# EAGLE design SD_A2 (EAGLE 7.2.0)
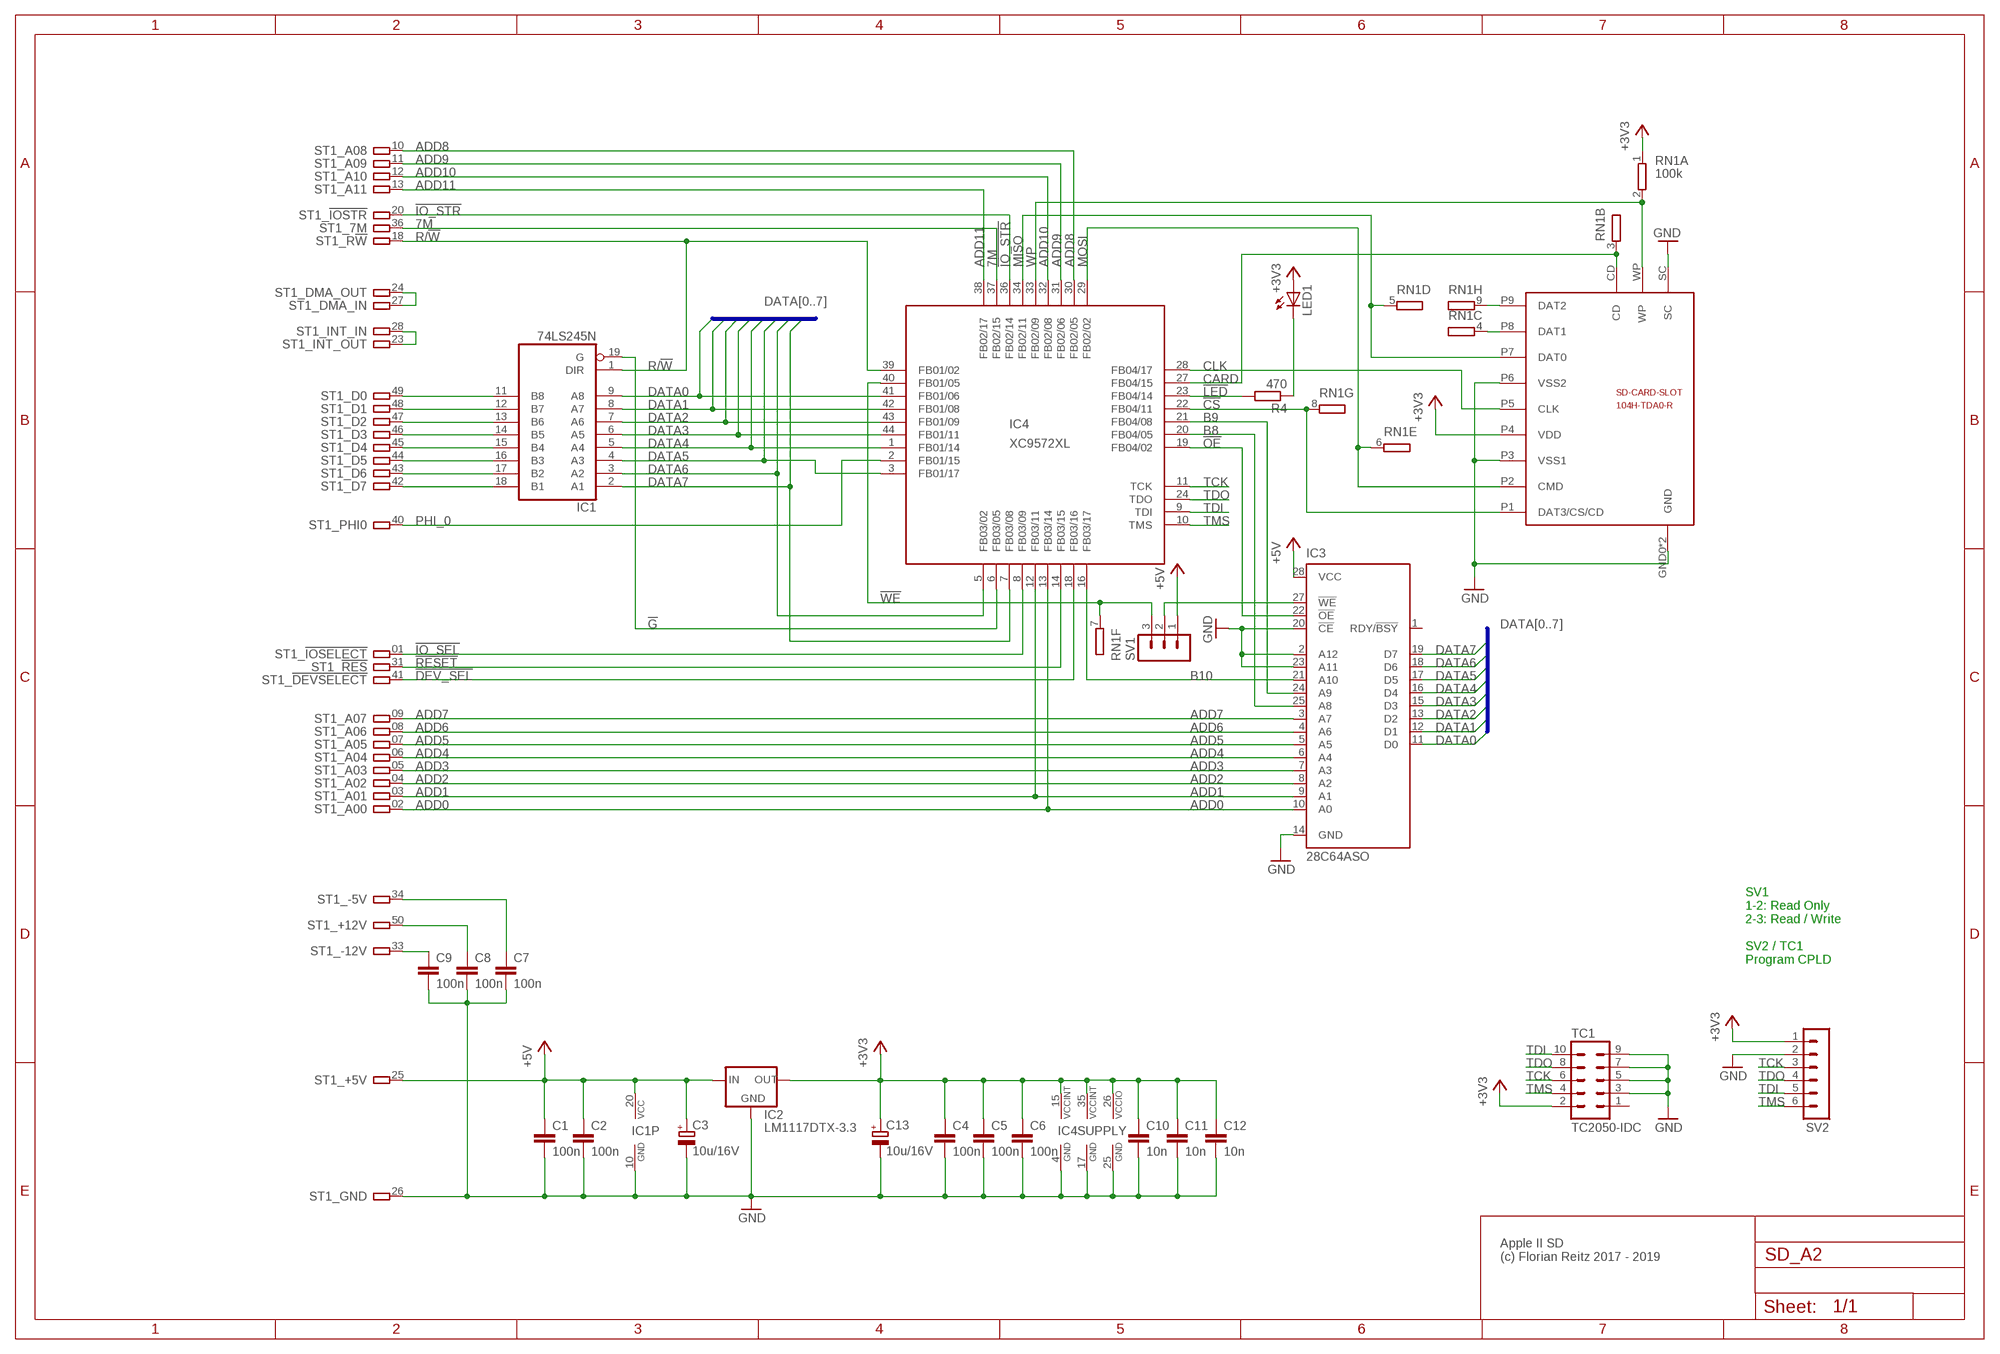
[diagram p0: schematic, sheet 1]

## Parts
C1  100n  C-EUC0603K  [C0603K]
C2  100n  C-EUC0603K  [C0603K]
C3  10u/16V  CPOL-EUA/3216-18R  [A/3216-18R]
C4  100n  C-EUC0603K  [C0603K]
C5  100n  C-EUC0603K  [C0603K]
C6  100n  C-EUC0603K  [C0603K]
C7  100n  C-EUC0603K  [C0603K]
C8  100n  C-EUC0603K  [C0603K]
C9  100n  C-EUC0603K  [C0603K]
C10  10n  C-EUC0603K  [C0603K]
C11  10n  C-EUC0603K  [C0603K]
C12  10n  C-EUC0603K  [C0603K]
C13  10u/16V  CPOL-EUA/3216-18R  [A/3216-18R]
IC1  74LS245N  [DIL20]
IC2  LM1117DTX-3.3  [TO252]
IC3  28C64ASO  [SO28W]
IC4  XC9572XL  XC9572_S44VQFP  [SQFP-S-10X10-44]
LED1  LEDSQR2X5  [LED2X5]
R4  470  R-EU_R0603  [R0603]
RN1  100k  GE08R  [SIL9]
ST1  A2-50PINSLOT1-3  [A2-50PIN-SL1-3]
SV1  MA03-1  [MA03-1]
SV2  MA06-1  [MA06-1]
TC1  TC2050-IDC  [TC2050-IDC]
U$2  104H-TDA0-R  [104H-TDA0-R]

## Nets
7M: IC4.37(FB02/15) ST1.36
!CS: IC4.22(FB04/11) RN1.8 U$2.P1(DAT3/CS/CD)
!DEV_SEL: IC4.18(FB03/16) ST1.41
!G: IC1.19(G) IC4.6(FB03/05)
!IO_SEL: IC4.8(FB03/09) ST1.01
!IO_STR: IC4.36(FB02/14) ST1.20
!LED: IC4.23(FB04/14) R4.2
!OE: IC3.22(!OE) IC4.19(FB04/02)
!RESET: IC4.14(FB03/15) ST1.31
!WE: IC4.40(FB01/05) RN1.7 SV1.3
+3V3: C4.1 C5.1 C6.1 C10.1 C11.1 C12.1 C13.+ IC2.TAB(OUT) IC4.15(VCCINT) IC4.26(VCCIO) IC4.35(VCCINT) LED1.A RN1.1 SV2.1 TC1.2 U$2.P4(VDD)
+5V: C1.1 C2.1 C3.+ IC1.20(VCC) IC2.2(IN) IC3.28(VCC) ST1.25 SV1.1
+12V: C8.1 ST1.50
-5V: C7.1 ST1.34
-12V: C9.1 ST1.33
ADD0: IC3.10(A0) IC4.13(FB03/14) ST1.02
ADD1: IC3.9(A1) IC4.12(FB03/11) ST1.03
ADD2: IC3.8(A2) ST1.04
ADD3: IC3.7(A3) ST1.05
ADD4: IC3.6(A4) ST1.06
ADD5: IC3.5(A5) ST1.07
ADD6: IC3.4(A6) ST1.08
ADD7: IC3.3(A7) ST1.09
ADD8: IC4.30(FB02/05) ST1.10
ADD9: IC4.31(FB02/06) ST1.11
ADD10: IC4.32(FB02/08) ST1.12
ADD11: IC4.38(FB02/17) ST1.13
B8: IC3.25(A8) IC4.20(FB04/05)
B9: IC3.24(A9) IC4.21(FB04/08)
B10: IC3.21(A10) IC4.16(FB03/17)
CARD: IC4.27(FB04/15) RN1.3 U$2.CD
CLK: IC4.28(FB04/17) U$2.P5(CLK)
D0: IC1.11(B8) ST1.49
D1: IC1.12(B7) ST1.48
D2: IC1.13(B6) ST1.47
D3: IC1.14(B5) ST1.46
D4: IC1.15(B4) ST1.45
D5: IC1.16(B3) ST1.44
D6: IC1.17(B2) ST1.43
D7: IC1.18(B1) ST1.42
DAT2: RN1.9 U$2.P9(DAT2)
DATA0: IC1.9(A8) IC3.11(D0) IC4.41(FB01/06)
DATA1: IC1.8(A7) IC3.12(D1) IC4.42(FB01/08)
DATA2: IC1.7(A6) IC3.13(D2) IC4.43(FB01/09)
DATA3: IC1.6(A5) IC3.15(D3) IC4.44(FB01/11)
DATA4: IC1.5(A4) IC3.16(D4) IC4.1(FB01/14)
DATA5: IC1.4(A3) IC3.17(D5) IC4.3(FB01/17)
DATA6: IC1.3(A2) IC3.18(D6) IC4.5(FB03/02)
DATA7: IC1.2(A1) IC3.19(D7) IC4.7(FB03/08)
DMA: ST1.24 ST1.27
GND: C1.2 C2.2 C3.- C4.2 C5.2 C6.2 C7.2 C8.2 C9.2 C10.2 C11.2 C12.2 C13.- IC1.10(GND) IC2.1(GND) IC3.2(A12) IC3.14(GND) IC3.20(!CE) IC3.23(A11) IC4.4(GND) IC4.17(GND) IC4.25(GND) ST1.26 SV2.2 TC1.3 TC1.5 TC1.7 TC1.9 U$2.GND0(GND) U$2.GND1(GND) U$2.P3(VSS1) U$2.P6(VSS2) U$2.SC
INT: ST1.23 ST1.28
MISO: IC4.34(FB02/11) RN1.5 U$2.P7(DAT0)
MOSI: IC4.29(FB02/02) RN1.6 U$2.P2(CMD)
N$1: IC3.27(!WE) SV1.2
N$2: RN1.4 U$2.P8(DAT1)
N$29: LED1.K(C) R4.1
PHI_0: IC4.2(FB01/15) ST1.40
R/!W: IC1.1(DIR) IC4.39(FB01/02) ST1.18
TCK: IC4.11(TCK) SV2.3 TC1.6
TDI: IC4.9(TDI) SV2.5 TC1.10
TDO: IC4.24(TDO) SV2.4 TC1.8
TMS: IC4.10(TMS) SV2.6 TC1.4
WP: IC4.33(FB02/09) RN1.2 U$2.WP
Unconnected: IC3.1(RDY/!BSY) ST1.14 ST1.15 ST1.16 ST1.17 ST1.19 ST1.21 ST1.22 ST1.29 ST1.30 ST1.32 ST1.35 ST1.37 ST1.38 ST1.39 TC1.1

## Buses
DATA[0..7]

## Notes on the sheet
- SV1
  1-2: Read Only
  2-3: Read / Write
  
  SV2 / TC1
  Program CPLD
- Apple II SD
  (c) Florian Reitz 2017 - 2019

## Library data of the parts
C1 C2 C4-C12 = rcl:C-EU: CAPACITOR, European symbol; SPICEPREFIX: C
C3 C13 = rcl@1:CPOL-EU: POLARIZED CAPACITOR, European symbol; SPICEPREFIX: C
IC1 = 74xx-eu:74*245: Octal BUS TRANSCEIVER, 3-state
IC2 = lm1117:LM1117DTX-*
IC3 = microchip:28*64A: CMOS EEPROM 64 K (8 K x 8), low voltage; MPN: CAT28C64BWI-12; OC_FARNELL: 1718312; OC_NEWARK: 06R0739
IC4 = xilinx-xc9:XC9572_S44
LED1 = led:LED: LED OSRAM: - CHIPLED LG R971, LG N971, LY N971, LG Q971, LY Q971, LO R971, LY R971 LH N974, LH R974 LS Q976, LO Q976, LY Q976 LO Q996 - Hyper CHIPLED LW Q18S LB Q993, LB Q99A, LB R99A - SideLED LS A670, LO A670, LY A670, LG A670, LP A670 LB A673, LV A673, LT A673, LW A673 LH A674 LY A675 LS A676, LA A676, LO A676, LY A676, LW A676 LS A679, LY A679, LG A679 - Hyper Micro SIDELED® LS Y876, LA Y876, LO Y876, LY Y876 LT Y87S - SmartLED LW L88C, LW L88S LB L89C, LB L89S, LG L890 LS L89K, LO L89K, LY L89K LS L896, LA L896, LO L896, LY L896 - TOPLED LS T670, LO T670, LY T670, LG T670, LP T670 LSG T670, LSP T670, LSY T670, LOP T670, LYG T670 LG T671, LOG T671, LSG T671 LB T673, LV T673, LT T673, LW T673 LH T674 LS T676, LA T676, LO T676, LY T676, LB T676, LH T676, LSB T676, LW T676 LB T67C, LV T67C, LT T67C, LS T67K, LO T67K, LY T67K, LW E67C LS E67B, LA E67B, LO E67B, LY E67B, LB E67C, LV E67C, LT E67C LW T67C LS T679, LY T679, LG T679 LS T770, LO T770, LY T770, LG T770, LP T770 LB T773, LV T773, LT T773, LW T773 LH T774 LS E675, LA E675, LY E675, LS T675 LS T776, LA T776, LO T776, LY T776, LB T776 LHGB T686 LT T68C, LB T68C - Hyper Mini TOPLED® LB M676 - Mini TOPLED Santana® LG M470 LS M47K, LO M47K, LY M47K Source: http://www.osram.convergy.de LUXEON: - LUMILED® LXK2-PW12-R00, LXK2-PW12-S00, LXK2-PW14-U00, LXK2-PW14-V00 LXK2-PM12-R00, LXK2-PM12-S00, LXK2-PM14-U00 LXK2-PE12-Q00, LXK2-PE12-R00, LXK2-PE12-S00, LXK2-PE14-T00, LXK2-PE14-U00 LXK2-PB12-K00, LXK2-PB12-L00, LXK2-PB12-M00, LXK2-PB14-N00, LXK2-PB14-P00, LXK2-PB14-Q00 LXK2-PR12-L00, LXK2-PR12-M00, LXK2-PR14-Q00, LXK2-PR14-R00 LXK2-PD12-Q00, LXK2-PD12-R00, LXK2-PD12-S00 LXK2-PH12-R00, LXK2-PH12-S00 LXK2-PL12-P00, LXK2-PL12-Q00, LXK2-PL12-R00 Source: www.luxeon.com KINGBRIGHT: KA-3528ASYC Source: www.kingbright.com
R4 = rcl:R-EU_: RESISTOR, European symbol; SPICEPREFIX: R
RN1 = resistor-sil:GE08R: SIL RESISTOR; OC_FARNELL: unknown; OC_NEWARK: unknown
ST1 = con-apple2:A2-50PIN: Apple ][ Peripheral Card Connector This is the, default, 50-pin connector for slot #1 to #7 Pins are laid out as seen from the top of the slot
SV1 = con-lstb:MA03-1: PIN HEADER; OC_FARNELL: unknown; OC_NEWARK: unknown
SV2 = con-lstb:MA06-1: PIN HEADER; OC_FARNELL: unknown; OC_NEWARK: unknown
TC1 = TagConnect:TC2050-IDC: Tag-Connect In Circuit Programming & Debug Cable 10 Pin http://www.tag-connect.com
U$2 = con-sd-attend2:104H-TDA0-R

## Board
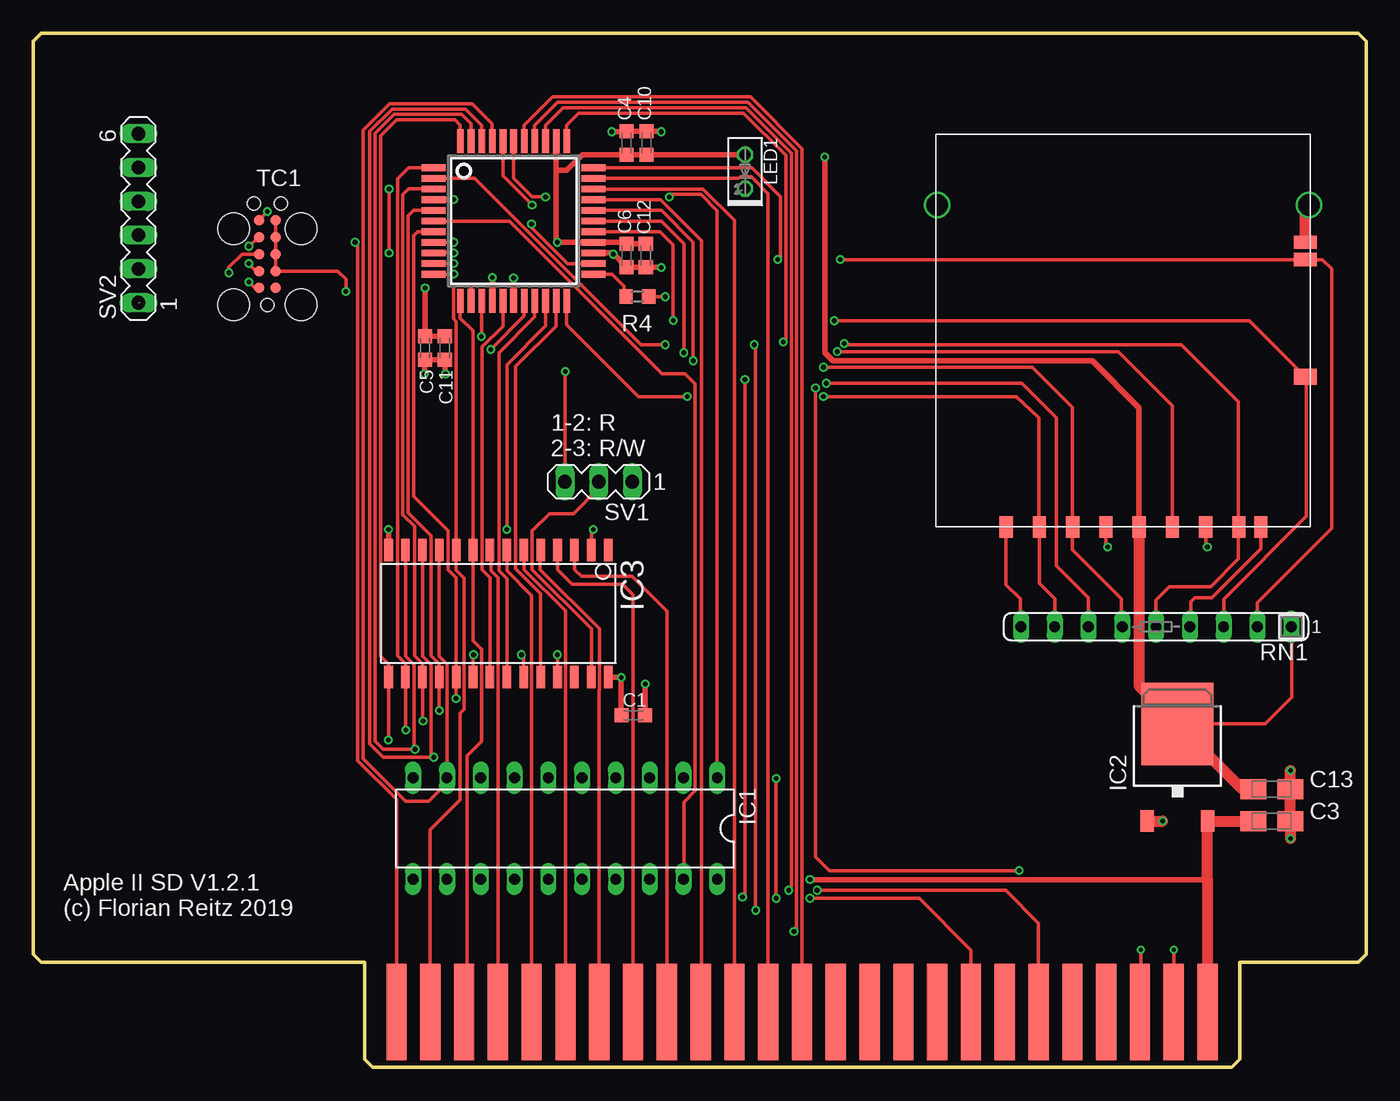
[diagram p1: board, top side]
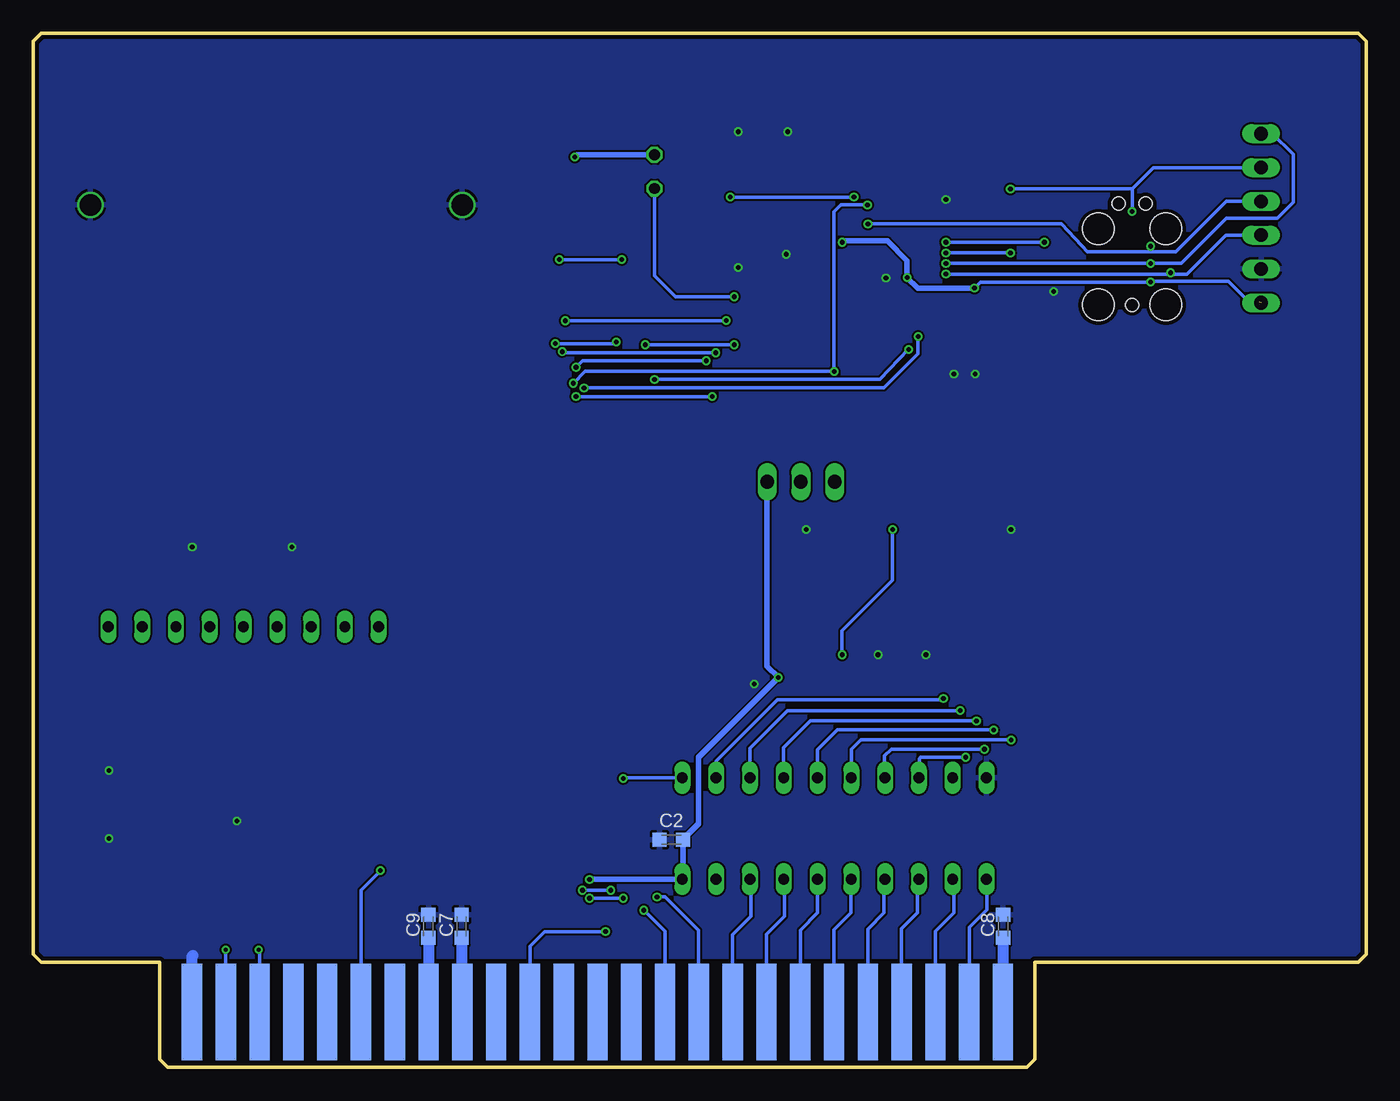
[diagram p2: board, bottom side, seen from below]

Size 100.2 x 77.7 mm. Coordinates in mm from the lower left corner, seen from the top.
Outline: 0.6,7.9 24.9,7.9 24.9,0.6 25.5,0 90.1,0 90.7,0.6 90.7,7.9 99.6,7.9 100.2,8.5 100.2,77.1 99.6,77.7 0.6,77.7 0,77.1 0,8.5 0.6,7.9
Copper layers (1*16): Top 0.035mm / dielectric 1.5mm / Bottom 0.035mm
Design rules "PCB-POOL Standard": minimum track width 0.15mm, minimum drill 0.3mm, track to track 0.15mm, track to pad 0.15mm, pad to pad 0.15mm, via to via 0.15mm, smd to smd 0.15mm, copper to edge 0.3mm, drill to drill 0.2mm, minimum pad ring 0.2mm, minimum via ring 0.15mm, stop-mask expansion 0.075mm, vias tented up to drill 0mil, thermal gap 0.2mm

### Footprints (pad centres in the part's own frame; a part is rotated, then mirrored left to right if it is on the bottom)
C0603K = smd 1.05 x 1.08: 1 -0.875,0; 2 0.875,0
A/3216-18R = smd 1.95 x 1.5: + 1.375,0; - -1.375,0
DIL20 = drill 0.813 long: 1 -11.43,-3.81; 2 -8.89,-3.81; 3 -6.35,-3.81; 4 -3.81,-3.81; 5 -1.27,-3.81; 6 1.27,-3.81; 7 3.81,-3.81; 8 6.35,-3.81; 9 8.89,-3.81; 10 11.43,-3.81; 11 11.43,3.81; 12 8.89,3.81; 13 6.35,3.81; 14 3.81,3.81; 15 1.27,3.81; 16 -1.27,3.81; 17 -3.81,3.81; 18 -6.35,3.81; 19 -8.89,3.81; 20 -11.43,3.81
TO252 = smd 1 x 1.6: 1 -2.28,-4.8; 2 2.28,-4.8 | smd 5.4 x 6.2: TAB 0,2.5
SO28W = smd 0.65 x 1.7: 1 -7.62,-4.78; 2 -6.35,-4.78; 3 -5.08,-4.78; 4 -3.81,-4.78; 5 -2.54,-4.78; 6 -1.27,-4.78; 7 0,-4.78; 8 1.27,-4.78; 9 2.54,-4.78; 10 3.81,-4.78; 11 5.08,-4.78; 12 6.35,-4.78; 13 7.62,-4.78; 14 8.89,-4.78; 15 8.89,4.78; 16 7.62,4.78; 17 6.35,4.78; 18 5.08,4.78; 19 3.81,4.78; 20 2.54,4.78; 21 1.27,4.78; 22 0,4.78; 23 -1.27,4.78; 24 -2.54,4.78; 25 -3.81,4.78; 26 -5.08,4.78; 27 -6.35,4.78; 28 -7.62,4.78
SQFP-S-10X10-44 = smd 0.5 x 1.8: 1 -4,-6; 2 -3.2,-6; 3 -2.4,-6; 4 -1.6,-6; 5 -0.8,-6; 6 0,-6; 7 0.8,-6; 8 1.6,-6; 9 2.4,-6; 10 3.2,-6; 11 4,-6; 23 4,6; 24 3.2,6; 25 2.4,6; 26 1.6,6; 27 0.8,6; 28 0,6; 29 -0.8,6; 30 -1.6,6; 31 -2.4,6; 32 -3.2,6; 33 -4,6 | smd 1.8 x 0.5: 12 6,-4; 13 6,-3.2; 14 6,-2.4; 15 6,-1.6; 16 6,-0.8; 17 6,0; 18 6,0.8; 19 6,1.6; 20 6,2.4; 21 6,3.2; 22 6,4; 34 -6,4; 35 -6,3.2; 36 -6,2.4; 37 -6,1.6; 38 -6,0.8; 39 -6,0; 40 -6,-0.8; 41 -6,-1.6; 42 -6,-2.4; 43 -6,-3.2; 44 -6,-4
LED2X5 = drill 0.813 octagon: A -1.27,0; K 1.27,0
R0603 = smd 1 x 1.1: 1 -0.85,0; 2 0.85,0
SIL9 = drill 0.813 long: 1 -10.16,0; 2 -7.62,0; 3 -5.08,0; 4 -2.54,0; 5 0,0; 6 2.54,0; 7 5.08,0; 8 7.62,0; 9 10.16,0
A2-50PIN-SL1-3 = smd 1.524 x 7.239: 01 -73.025,4.064; 02 -70.485,4.064; 03 -67.945,4.064; 04 -65.405,4.064; 05 -62.865,4.064; 06 -60.325,4.064; 07 -57.785,4.064; 08 -55.245,4.064; 09 -52.705,4.064; 10 -50.165,4.064; 11 -47.625,4.064; 12 -45.085,4.064; 13 -42.545,4.064; 14 -40.005,4.064; 15 -37.465,4.064; 16 -34.925,4.064; 17 -32.385,4.064; 18 -29.845,4.064; 19 -27.305,4.064; 20 -24.765,4.064; 21 -22.225,4.064; 22 -19.685,4.064; 23 -17.145,4.064; 24 -14.605,4.064; 25 -12.065,4.064 | smd 1.524 x 7.239 bottom: 26 -12.065,4.064; 27 -14.605,4.064; 28 -17.145,4.064; 29 -19.685,4.064; 30 -22.225,4.064; 31 -24.765,4.064; 32 -27.305,4.064; 33 -29.845,4.064; 34 -32.385,4.064; 35 -34.925,4.064; 36 -37.465,4.064; 37 -40.005,4.064; 38 -42.545,4.064; 39 -45.085,4.064; 40 -47.625,4.064; 41 -50.165,4.064; 42 -52.705,4.064; 43 -55.245,4.064; 44 -57.785,4.064; 45 -60.325,4.064; 46 -62.865,4.064; 47 -65.405,4.064; 48 -67.945,4.064; 49 -70.485,4.064; 50 -73.025,4.064
MA03-1 = drill 1.016 long: 1 -2.54,0; 2 0,0; 3 2.54,0
MA06-1 = drill 1.016 long: 1 -6.35,0; 2 -3.81,0; 3 -1.27,0; 4 1.27,0; 5 3.81,0; 6 6.35,0
TC2050-IDC = smd 0.787 x 0.787: 1 -2.54,-0.635; 2 -2.54,0.635; 3 -1.27,-0.635; 4 -1.27,0.635; 5 0,-0.635; 6 0,0.635; 7 1.27,-0.635; 8 1.27,0.635; 9 2.54,-0.635; 10 2.54,0.635 | hole 0.991: -3.81,0; 3.81,1.016; 3.81,-1.016 | hole 2.375: -3.81,2.54; -3.81,-2.54; 1.905,2.54; 1.905,-2.54
104H-TDA0-R = smd 1.2 x 1.75: CD 11.3,-13.125 | drill 1.6: GND0 24.2,-13.4; GND1 24.2,14.55 | smd 1.6 x 1: P1 0,6.875; P2 0,4.375; P3 0,1.875; P4 0,-0.625; P5 0,-3.125; P6 0,-5.625; P7 0,-8.125; P8 0,-9.775; P9 0,9.375 | smd 1 x 1.75: SC 21.4,-13.125; WP 20.1,-13.125

### Placement (x,y rotation side)
C1  45.1,26.45 0 top
C2  52.25,17.1 180 bottom
C3  93.1,18.5 180 top
C4  44.6,69.45 90 top
C5  29.45,54.05 270 top
C6  44.6,61 270 top
C7  68,10.6 90 bottom
C8  27.3,10.6 90 bottom
C9  70.5,10.6 90 bottom
C10  46.1,69.45 90 top
C11  30.95,54.05 270 top
C12  46.05,61 270 top
C13  93.1,20.9 180 top
IC1  39.98,17.95 180 top
IC2  86,23.3 0 top
IC3  35.6,34.1 180 top
IC4  36.11,63.59 270 top
LED1  53.51,67.3 270 top
R4  45.41,57.92 180 top
RN1  84.4,33.1 180 top
ST1  100.33,0.1 0 top
SV1  42.5,44 180 top
SV2  7.9,63.8 90 top
TC1  17.6,61.1 90 top
U$2  82.5,40.6 90 top

### Tracks (layer width: path | path; a pad name or v marks a point on that pad's centre or on a via)
7M  (via drill 0.35)
  Top 0.254: v57.18,10.2 57.38,10.4 57.38,68.86 53.73,72.51 39.41,72.51 37.7,70.8 IC4.37
  Bottom 0.254: ST1.36 62.87,9.09 61.75,10.2 v57.18,10.2
  Bottom 0.4: 62.97,4.64 ST1.36
!CS  (via drill 0.35)
  Top 0.254: IC4.22 40.1,55.8 45.5,50.4 v49.15,50.4 | RN1.8 76.8,33.12 76.8,35.2 75.62,36.38 U$2.P1 75.6,40.62 75.6,48.8 73.9,50.4 v59.4,50.4
  Bottom 0.254: v59.4,50.4 v49.15,50.4
!DEV_SEL  (via drill 0.35)
  Top 0.254: IC4.18 36.91,56.46 v34.4,53.95 | v53.5,51.69 53.5,12.89 53.41,12.8 v53.31,12.8
  Bottom 0.254: ST1.41 50.2,4.58 50.2,10.3 52.7,12.8 v53.31,12.8 | v53.5,51.69 36.55,51.69 v34.4,53.95
!G
  Top 0.254: IC1.19 48.9,14.17 48.9,19.93 49.75,20.79 49.75,51.35 49,52.1 47.28,52.1 35.81,63.57 35.81,63.59 IC4.6
!IO_SEL  (via drill 0.35)
  Top 0.254: ST1.01 27.3,4.55 27.3,20.13 24.4,23.03 24.4,61.8 v24.2,62 | IC4.8 v31.59,61.99 v31.6,62
  Bottom 0.254: v31.6,62 v24.2,62
!IO_STR  (via drill 0.35)
  Top 0.254: IC4.36 38.5,70.8 39.81,72.11 53.56,72.11 56.98,68.69 56.98,13.6 56.78,13.4 v56.78,13.3 | ST1.20 75.56,10.83 73.1,13.3 v58.92,13.3
  Bottom 0.254: v56.78,13.3 v58.92,13.3
!LED
  Top 0.254: IC4.23 43.51,59.59 44.4,58.7 44.4,58.08 R4.2
!OE
  Top 0.254: IC3.22 35.6,36.73 35,37.33 35,53.7 37.7,56.4 IC4.19
!RESET  (via drill 0.35)
  Top 0.254: IC4.14 33.71,54.96 v33.67,54.93 | v58.8,51.05 58.8,15.81 59.83,14.78 v74.1,14.78
  Bottom 0.254: 75.6,4.58 ST1.31 75.56,13.31 v74.1,14.78 | v33.67,54.93 33.7,54.9 33.7,53.6 36.25,51.05 v58.8,51.05 58.74,51.09
!WE  (via drill 0.35)
  Top 0.254: 35.31,68.85 IC4.40 35.3,67 v37.5,64.8 | v59.6,51.4 74.3,51.4 76.9,48.8 76.9,37.7 79.3,35.3 79.3,33.12 RN1.7 | v39.99,52.29 39.99,44.03 SV1.3
  Bottom 0.254: v39.99,52.29 58.71,52.29 v59.6,51.4 | 40,52.31 v39.99,52.29 | v37.5,64.8 39.5,64.8 40,64.3 40,52.31 v39.99,52.29
+3V3  (via drill 0.35)  (1 unrouted)
  Top 0.254: 83.25,40.73 U$2.P4 | 44.48,61.99 C6.1 | LED1.A | 39.33,67.4 39.31,67.42 | 60.88,53.1 | v39.4,61.99 v39.4,62 39.31,62.08 | IC2.TAB 92.6,25.8 94.6,27.8 94.6,33.06 RN1.1 | 16.74,58.56 TC1.2 16.64,58.56 v16.2,59
  Top 0.406: v59.5,68.4 59.5,53.7 60.11,53.1 60.88,53.1 | 44.48,61.99 IC4.26 v39.4,61.99 | C6.1 C12.1 | LED1.A C10.1 C4.1 41.27,68.57 40.1,67.4 39.33,67.4 | IC4.15 v34.51,59.34 | IC4.35 39.31,67.42 39.31,62.08 | C11.1 C5.1 v29.45,58.55 | U$2.P4 83.12,49.58 79.6,53.1 60.88,53.1
  Top 0.813: U$2.P4 83.12,28.68 IC2.TAB 90.9,20.9 C13.+
  Bottom 0.254: 59.33,68.57 v59.5,68.4 | 39.29,62.1 v39.4,62 | v29.45,58.55 29,59 v16.2,59 16.15,59.05 10.35,59.05 8.8,57.5 8.05,57.5
  Bottom 0.406: LED1.A 59.33,68.57 | 39.29,62.1 36,62.1 34.51,60.61 v34.51,59.34 33.72,58.55 v29.45,58.55
+5V  (via drill 0.35)
  Top 0.254: 44.18,29.32 v44.2,29.3
  Top 0.406: IC3.28 44.18,29.32 | v44.2,29.3 44.2,26.48 C1.1 | 88.27,14.08 88.25,14.1 v58.39,14.1
  Top 0.813: ST1.25 88.27,14.08 88.27,18.49 IC2.2 C3.+
  Bottom 0.254: v44.2,29.3 44.23,29.33 | 51.38,14.17 IC1.20 | C2.1 51.38,17.12
  Bottom 0.406: 51.38,14.17 C2.1 | 51.38,17.12 50.2,18.3 50.2,23.3 v44.2,29.3 45.04,30.14 SV1.1 | IC1.20 58.35,14.14 v58.39,14.1
+12V
  Bottom 0.254: ST1.50 27.3,4.55
  Bottom 0.813: C8.1 27.3,4.55 ST1.50
-5V
  Bottom 0.254: 68,4.6 ST1.34
  Bottom 0.813: C7.1 68,4.6
-12V
  Bottom 0.254: 70.5,4.56 ST1.33
  Bottom 0.813: C9.1 70.5,4.56
ADD0
  Top 0.254: IC3.10 | IC3.10 31.79,37.37 32.4,36.76 32.4,26.9 32.1,26.6 32.1,20.1 29.84,17.85 ST1.02 | IC4.13 32.91,58.59 32.7,58.8 31.78,58.8 31.58,58.61 31.58,56.25 31.79,56.04 IC3.10
ADD1
  Top 0.254: ST1.03 32.6,4.76 32.6,23.4 33.7,24.5 33.7,31.4 33.06,32.04 IC3.9 33.06,55.34 32.1,56.3 IC4.12
ADD2
  Top 0.254: ST1.04 34.92,28.35 34.93,28.36 34.93,36.77 34.4,37.3 34.4,38.81 IC3.8
ADD3
  Top 0.254: ST1.05 37.47,28.35 37.47,28.36 37.47,35.43 35.6,37.3 IC3.7
ADD4
  Top 0.254: ST1.06 40.01,28.35 40.01,28.36 40.01,34.29 36.9,37.4 36.9,38.85 IC3.6
ADD5
  Top 0.254: ST1.07 42.55,28.35 42.55,28.36 42.55,32.95 38.1,37.4 38.1,38.84 IC3.5
ADD6
  Top 0.254: ST1.08 45.1,4.56 45.1,35.5 44.3,36.3 40.5,36.3 39.4,37.4 IC3.4
ADD7
  Top 0.254: ST1.09 47.62,34.27 45,36.9 41.2,36.9 40.7,37.4 40.7,38.86 IC3.3
ADD8
  Top 0.254: ST1.10 50.25,4.63 50.25,62.1 47.16,65.19 IC4.30
ADD9
  Top 0.254: ST1.11 52.7,63.65 50.36,65.99 IC4.31
ADD10
  Top 0.254: ST1.12 55.24,65.66 53.99,66.91 53.88,66.91 | IC4.32 53.02,66.79 53.14,66.91 53.88,66.91 | 53.88,66.91 53.89,66.9
ADD11
  Top 0.254: IC4.38 36.9,70.8 39.02,72.92 53.9,72.92 57.78,69.03 ST1.13
B8  (via drill 0.35)
  Top 0.254: IC4.20 38.51,55.71 35.6,52.8 v35.6,40.4 | IC3.25 v39.41,30.99 v39.4,31
  Bottom 0.254: v39.4,31 39.4,32.8 35.6,36.6 v35.6,40.4
B9
  Top 0.254: IC3.24 38.14,35.59 36.27,37.46 36.27,52.67 39.3,55.7 IC4.21
B10
  Top 0.254: IC3.21 34.33,36.8 33.73,37.4 33.73,54.13 35.3,55.7 IC4.16
CARD  (via drill 0.35)
  Top 0.254: IC4.27 47.11,62.79 48.1,61.8 v48.1,56.1 | v60.2,56.1 91.42,56.1 U$2.CD 95.7,51.83 95.7,41.4 89.48,35.18 RN1.3
  Bottom 0.254: v48.1,56.1 60.1,56.1 v60.2,56.1
CLK  (via drill 0.35)
  Top 0.254: U$2.P5 85.62,49.73 81.58,53.77 v60.43,53.77 | IC4.28 47.21,63.59 48.9,61.9 v48.9,53.7
  Bottom 0.254: v48.9,53.7 60.35,53.7 v60.43,53.77
D0
  Bottom 0.254: ST1.49 29.84,10.5 28.5,11.85 28.5,14.09 IC1.11
D1
  Bottom 0.254: ST1.48 32.38,10.21 31,11.6 31,14.05 IC1.12
D2
  Bottom 0.254: ST1.47 34.92,10.42 33.75,11.6 33.75,14.02 IC1.13
D3
  Bottom 0.254: ST1.46 37.47,10.38 36.25,11.6 36.25,14.06 IC1.14
D4
  Bottom 0.254: ST1.45 40.01,10.34 38.75,11.6 38.75,14.1 IC1.15
D5
  Bottom 0.254: ST1.44 42.55,10.3 41.25,11.6 IC1.16
D6
  Bottom 0.254: ST1.43 45.09,10.01 43.75,11.35 43.75,14.1 IC1.17
D7
  Bottom 0.254: ST1.42 47.62,9.97 46.25,11.35 46.25,14.06 IC1.18
DAT2
  Top 0.254: U$2.P9 73.12,36.27 74.2,35.2 74.2,33.14 RN1.9
DATA0
  Top 0.254: 30.5,38.9 IC3.11 30.52,30.89 31.12,30.29 31.12,21.79 IC1.9 31.09,21.39 29.7,20 28,20 24.8,23.2 24.8,70.41 26.8,72.41 32.99,72.41 34.5,70.9 IC4.41
DATA1  (via drill 0.35)
  Top 0.254: 29.3,38.93 IC3.12 29.25,30.89 29.9,30.24 29.9,23.5 v30.1,23.3 28.45,23.3 26.3,23.3 25.29,24.31 25.29,70.34 26.96,72.01 32.49,72.01 33.7,70.8 IC4.42
  Bottom 0.254: v30.1,23.3 33.5,23.3 33.6,23.2 33.6,21.79 IC1.8
DATA2  (via drill 0.35)
  Top 0.254: IC3.13 27.98,30.89 28.61,30.25 28.61,23.99 v28.7,23.9 26.3,23.9 25.7,24.5 25.7,38.32 25.7,38.33 25.7,70.17 27.13,71.6 32.2,71.6 32.9,70.9 IC4.43
  Bottom 0.254: v28.7,23.9 35.7,23.9 36.2,23.4 36.2,21.79 IC1.7
DATA3  (via drill 0.35)
  Top 0.254: IC3.15 v26.71,24.61 v26.7,24.6 | IC4.44 32.1,70.8 31.7,71.2 27.3,71.2 26.1,70 26.1,30.9 26.71,30.29 IC3.15 | IC3.15
  Bottom 0.254: v26.7,24.6 38,24.6 38.71,23.89 IC1.6
DATA4  (via drill 0.35)
  Top 0.254: v28.01,25.35 27.98,25.38 IC3.16 27.98,30.32 27.38,30.92 27.38,66.78 28.2,67.6 IC4.1
  Bottom 0.254: v28.01,25.35 39.75,25.35 41.25,23.85 IC1.5
DATA5  (via drill 0.35)
  Top 0.254: v29.3,26.03 29.25,26.08 IC3.17 29.25,30.32 28.65,30.92 28.65,40.65 27.78,41.52 27.78,65.58 28.2,66 IC4.3
  Bottom 0.254: IC1.4 43.79,23.21 43.8,23.22 43.8,24 41.77,26.03 v29.3,26.03
DATA6  (via drill 0.35)
  Top 0.254: IC4.5 28.6,64.4 28.19,63.99 28.19,41.69 29.92,39.95 29.92,30.92 30.52,30.32 IC3.18 v30.52,26.8
  Bottom 0.254: IC1.3 46.33,23.97 43.5,26.8 v30.52,26.8
DATA7  (via drill 0.35)
  Top 0.254: v31.78,27.7 IC3.19 31.79,36.8 31.19,37.4 31.19,39.84 31.2,39.86 31.2,40.3 28.59,42.91 28.59,62.49 28.89,62.79 IC4.7
  Bottom 0.254: v31.78,27.7 31.88,27.6 44.25,27.6 48.87,22.98 IC1.2
DMA  (via drill 0.3 pad 0.6)
  Top 0.254: ST1.27 85.72,8.82 v85.75,8.85
  Bottom 0.254: v85.75,8.85 85.75,4.57 ST1.27
GND  (via drill 0.35)
  Top 0.254: U$2.P3 80.62,39.23 v80.75,39.1 | U$2.P6 88.12,39.23 v88.25,39.1 | IC3.2 41.95,40.25 v42.1,40.4 | IC3.23 36.87,30.83 v36.7,31 | IC3.20 33.06,30.96 v33.1,31 | v26.71,40.4 | v31.59,65.19 v31.6,65.2 | v36.11,59.29 v36.1,59.3 | 47.17,60.12 v47.2,60.1 | 47.17,70.32 v47.2,70.3 | 45.98,28.78 v46,28.8 | 30.95,52.15 v31,52.1 | v23.5,58.3 23.5,59.2 22.87,59.83 TC1.3 TC1.5 TC1.7 TC1.9
  Top 0.406: IC3.14 v26.71,40.4 | IC4.4 v31.59,65.19 | IC4.17 v36.11,59.29 | IC4.25 43.53,61.19 C6.2 C12.2 47.17,60.12 | C4.2 C10.2 47.17,70.32 | C1.2 45.98,28.78 | C5.2 C11.2 30.95,52.15 | 44.6,70.3 v43.5,70.3 | 29.5,53.1 29.4,53.1 v29.4,52.1
  Top 0.813: IC2.1 v84.9,18.5 | C3.- C13.- 94.47,22.28 v94.5,22.3 | U$2.SC 95.62,64.52 U$2.GND0 | 94.5,18.5 v94.5,17.2
  Bottom 0.813: ST1.26 88.27,8.33 88.2,8.4
  other vias: 43.6,61.1
  pour Bottom: 0.5,77.35 99.75,77.35 99.75,8.35 0.5,8.35
INT  (via drill 0.3 pad 0.6)
  Top 0.254: v83.25,8.85 83.25,4.61 ST1.23
  Bottom 0.254: ST1.23 83.19,8.79 v83.25,8.85
MISO  (via drill 0.35)
  Top 0.254: 90.6,40.58 90.6,38.2 88.5,36.1 85.4,36.1 84.4,35.1 RN1.5 | 90.6,40.58 U$2.P7 | 90.6,40.58 90.6,50 86.3,54.3 61.03,54.3 v60.96,54.38 | IC4.34 40.1,70.8 41.01,71.7 53.4,71.7 56.57,68.53 56.57,54.69 v56.38,54.5
  Bottom 0.254: v60.96,54.38 56.49,54.38 v56.38,54.5
MOSI  (via drill 0.35)
  Top 0.254: U$2.P2 78.1,40.58 | IC4.29 47.21,64.39 49.6,62 v49.6,53.09 | U$2.P2 78.12,38.88 81.8,35.2 81.8,33.16 RN1.6 | v59.4,52.6 75.1,52.6 78.1,49.6 78.1,40.62 U$2.P2
  Bottom 0.254: v49.6,53.09 58.91,53.09 v59.4,52.6
N$1
  Top 0.254: IC3.27 41.95,32.95 37.5,37.4 37.5,40.3 38.8,41.6 40.6,41.6 42.5,43.5 SV1.2
N$2
  Top 0.254: U$2.P8 92.28,38.98 88.6,35.3 87.3,35.3 87,35 87,33.16 RN1.4
N$29  (via drill 0.35)
  Top 0.254: R4.1 47.48,57.92 v47.5,57.9
  Bottom 0.254: v47.5,57.9 51.93,57.9 53.51,59.48 LED1.K
PHI_0  (via drill 0.35)
  Top 0.254: IC4.2 33.18,66.79 45.67,54.3 v47.5,54.3 | v54.3,11.8 54.3,54.2 v54.2,54.3
  Bottom 0.254: v54.2,54.3 v47.5,54.3 | ST1.40 52.7,10.21 v54.3,11.8
R/!W  (via drill 0.35)
  Top 0.254: IC4.39 36.1,66.8 37.5,65.4 v38.51,65.4 | v55.85,21.7 v55.85,12.7 | ST1.18 70.5,4.56 70.5,8.8 66.6,12.7 v58.39,12.7 | IC1.1 51.41,64.09 51.4,64.1 51.4,64.38 50.19,65.59 48.01,65.59 v47.81,65.39
  Bottom 0.254: IC1.1 55.79,21.76 v55.85,21.7 | v47.81,65.39 38.72,65.39 v38.51,65.4 | v55.85,12.7 v58.39,12.7
TCK  (via drill 0.35)
  Top 0.254: IC4.11 v31.59,59.59 v31.6,59.6 | TC1.6 15.7,61.1 14.7,60.1 v14.7,59.7 14.7,59.6
  Bottom 0.254: v31.6,59.6 14.7,59.6 v14.7,59.7 14.6,59.6 13.5,59.6 10.57,62.53 SV2.3
TDI  (via drill 0.35)
  Top 0.254: IC4.9 v31.59,61.19 v31.6,61.2 | TC1.10 16.96,63.66 v17.6,64.3 | v26.75,66 v26.75,61.2
  Bottom 0.254: v26.75,61.2 v31.6,61.2 | 17.6,66 v26.75,66 | 17.6,66 v17.6,64.3 | 17.6,66 15.99,67.61 SV2.5
TDO  (via drill 0.35)
  Top 0.254: v37.45,63.37 37.45,63.09 40.15,60.39 IC4.24 | TC1.8 v16.2,61.7
  Bottom 0.254: v37.45,63.37 37.42,63.4 23.4,63.4 | 23.4,63.4 | 23.4,63.4 22.9,63.4 21.38,61.72 20.96,61.3 16.2,61.3 | 16.2,61.3 14.3,61.3 10.53,65.07 SV2.4 | v16.2,61.7 16.2,61.3
TMS  (via drill 0.35)
  Top 0.254: IC4.10 v31.59,60.39 v31.6,60.4 | TC1.4 16.75,59.83 16.2,60.38 | 16.2,60.38 v16.19,60.39 | v16.2,60.4 16.2,60.38
  Bottom 0.254: v31.6,60.4 v16.2,60.4 13.9,60.4 10.5,63.8 6.7,63.8 5.5,65 5.5,68.6 7.1,70.2 7.95,70.2 SV2.6
WP  (via drill 0.35)
  Top 0.254: 95.67,60.66 U$2.WP | U$2.WP 96.9,60.7 97.6,60 97.6,40.5 92,34.9 92,33.12 RN1.2 | U$2.WP v60.65,60.7 | v55.97,60.7 56.17,60.9 56.17,65.43 54.01,67.59 IC4.33
  Bottom 0.254: v55.97,60.7 v60.65,60.7

### Text on the board
tNames: 1-2: R / 2-3: R/W | Apple II SD V1.2.1 / (c) Florian Reitz 2019